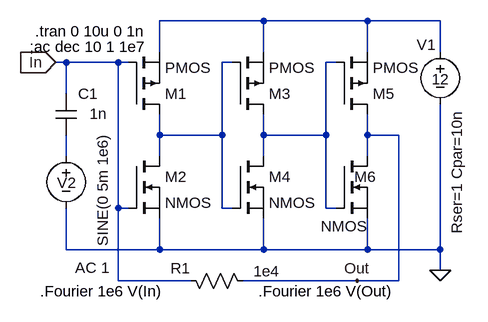
[diagram p0: schematic CmosLinTest.asc]
CmosLinTest.asc, the LTspice schematic file:
Version 4
SHEET 1 880 680
WIRE -224 32 -240 32
WIRE -224 80 -224 32
WIRE -224 176 -224 144
WIRE -224 320 -224 256
WIRE -144 32 -224 32
WIRE -144 256 -144 32
WIRE -144 368 -144 256
WIRE -128 32 -144 32
WIRE -128 256 -144 256
WIRE -80 16 -80 -32
WIRE -80 144 -80 112
WIRE -80 176 -80 144
WIRE -80 320 -224 320
WIRE -80 320 -80 272
WIRE -32 368 -144 368
WIRE 16 144 -80 144
WIRE 16 144 16 32
WIRE 16 256 16 144
WIRE 32 32 16 32
WIRE 32 256 16 256
WIRE 80 -32 -80 -32
WIRE 80 16 80 -32
WIRE 80 144 80 112
WIRE 80 176 80 144
WIRE 80 320 -80 320
WIRE 80 320 80 272
WIRE 176 144 80 144
WIRE 176 144 176 32
WIRE 176 256 176 144
WIRE 192 32 176 32
WIRE 192 256 176 256
WIRE 224 368 48 368
WIRE 240 -32 80 -32
WIRE 240 16 240 -32
WIRE 240 144 240 112
WIRE 240 176 240 144
WIRE 240 320 80 320
WIRE 240 320 240 272
WIRE 288 144 240 144
WIRE 288 368 224 368
WIRE 288 368 288 144
WIRE 352 -32 240 -32
WIRE 352 16 352 -32
WIRE 352 320 240 320
WIRE 352 320 352 96
WIRE 352 352 352 320
FLAG 352 352 0
FLAG 224 368 Out
FLAG -240 32 In
IOPIN -240 32 In
SYMBOL voltage 352 0 M0
WINDOW 0 7 5 Left 0
WINDOW 3 -14 58 Left 0
WINDOW 123 0 0 Left 0
WINDOW 39 -26 103 VRight 0
SYMATTR InstName V1
SYMATTR Value 12
SYMATTR SpiceLine Rser=1 Cpar=10n
SYMBOL res -48 352 M90
WINDOW 0 12 0 VBottom 0
WINDOW 3 -14 133 VTop 0
SYMATTR InstName R1
SYMATTR Value 1e4
SYMATTR SpiceLine tol=1 pwr=0.1
SYMBOL voltage -224 160 M0
WINDOW 0 -15 57 Left 0
WINDOW 3 -56 155 VLeft 0
WINDOW 123 -67 188 Left 0
WINDOW 39 0 0 Left 0
SYMATTR InstName V2
SYMATTR Value SINE(0 5m 1e6)
SYMATTR Value2 AC 1
SYMBOL cap -208 80 M0
WINDOW 0 -33 0 Left 0
WINDOW 3 -47 31 Left 0
SYMATTR InstName C1
SYMATTR Value 1n
SYMBOL pmos -128 112 M180
SYMATTR InstName M1
SYMBOL pmos 32 112 M180
SYMATTR InstName M3
SYMBOL pmos 192 112 M180
SYMATTR InstName M5
SYMBOL nmos -128 176 R0
SYMATTR InstName M2
SYMBOL nmos 32 176 R0
SYMATTR InstName M4
SYMBOL nmos 192 176 R0
WINDOW 0 28 32 Left 0
WINDOW 3 -24 108 Left 0
SYMATTR InstName M6
TEXT -272 -16 Left 0 !.tran 0 10u 0 1n
TEXT 72 384 Left 0 !.Fourier 1e6 V(Out)
TEXT -264 384 Left 0 !.Fourier 1e6 V(In)
TEXT -280 8 Left 0 !;ac dec 10 1 1e7

The netlist it stands for:
* CmosLinTest.asc
V1 N002 0 12 Rser=1 Cpar=10n
R1 In Out 1e4 tol=1 pwr=0.1
V2 N001 0 SINE(0 5m 1e6) AC 1
C1 In N001 1n
M1 N003 In N002 N002 PMOS
M3 N004 N003 N002 N002 PMOS
M5 Out N004 N002 N002 PMOS
M2 N003 In 0 0 NMOS
M4 N004 N003 0 0 NMOS
M6 Out N004 0 0 NMOS
.model NMOS NMOS
.model PMOS PMOS
.lib standard.mos
.tran 0 10u 0 1n
.Fourier 1e6 V(Out)
.Fourier 1e6 V(In)
;ac dec 10 1 1e7
.backanno
.end